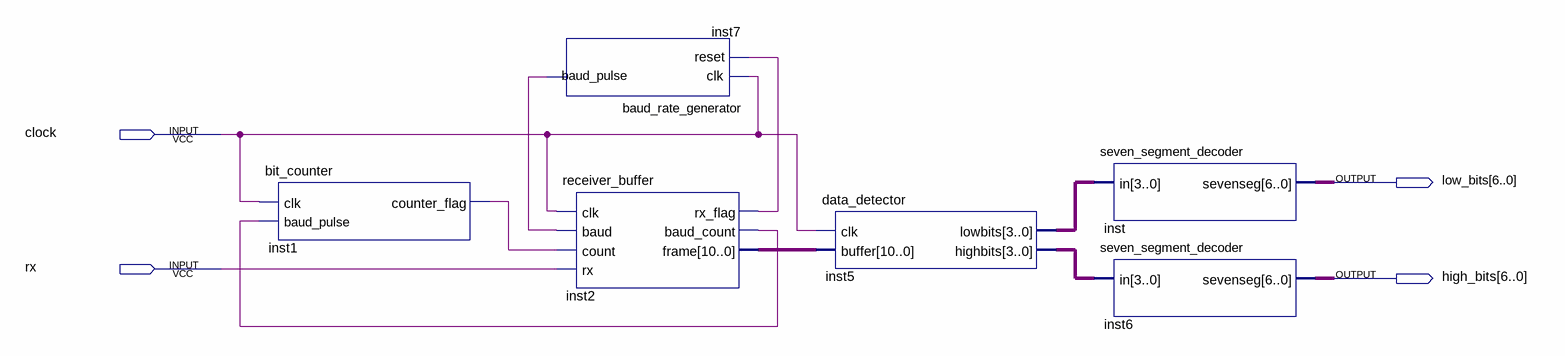
[diagram p0: schematic sheet]
// Quartus schematic uart_rx.bdf as structural Verilog: 6 symbols, 4 pins
module uart_rx (
  input  clock,
  input  rx,
  output [6:0] low_bits,
  output [6:0] high_bits
);

  wire inst1_counter_flag, inst2_baud_count, inst2_rx_flag, inst7_baud_pulse;
  wire [3:0] inst5_highbits, inst5_lowbits;
  wire [10:0] inst2_frame;

  bit_counter inst1 (.clk(clock), .baud_pulse(inst2_baud_count), .counter_flag(inst1_counter_flag));
  baud_rate_generator inst7 (.clk(clock), .reset(inst2_rx_flag), .baud_pulse(inst7_baud_pulse));
  receiver_buffer inst2 (
    .clk(clock), .baud(inst7_baud_pulse), .count(inst1_counter_flag), .rx(rx), .rx_flag(inst2_rx_flag),
    .baud_count(inst2_baud_count), .frame(inst2_frame));
  data_detector inst5 (.clk(clock), .buffer(inst2_frame), .lowbits(inst5_lowbits), .highbits(inst5_highbits));
  seven_segment_decoder inst (.in(inst5_lowbits), .sevenseg(low_bits));
  seven_segment_decoder inst6 (.in(inst5_highbits), .sevenseg(high_bits));
endmodule
